# EAGLE design tlcbuffer (EAGLE 5.11)
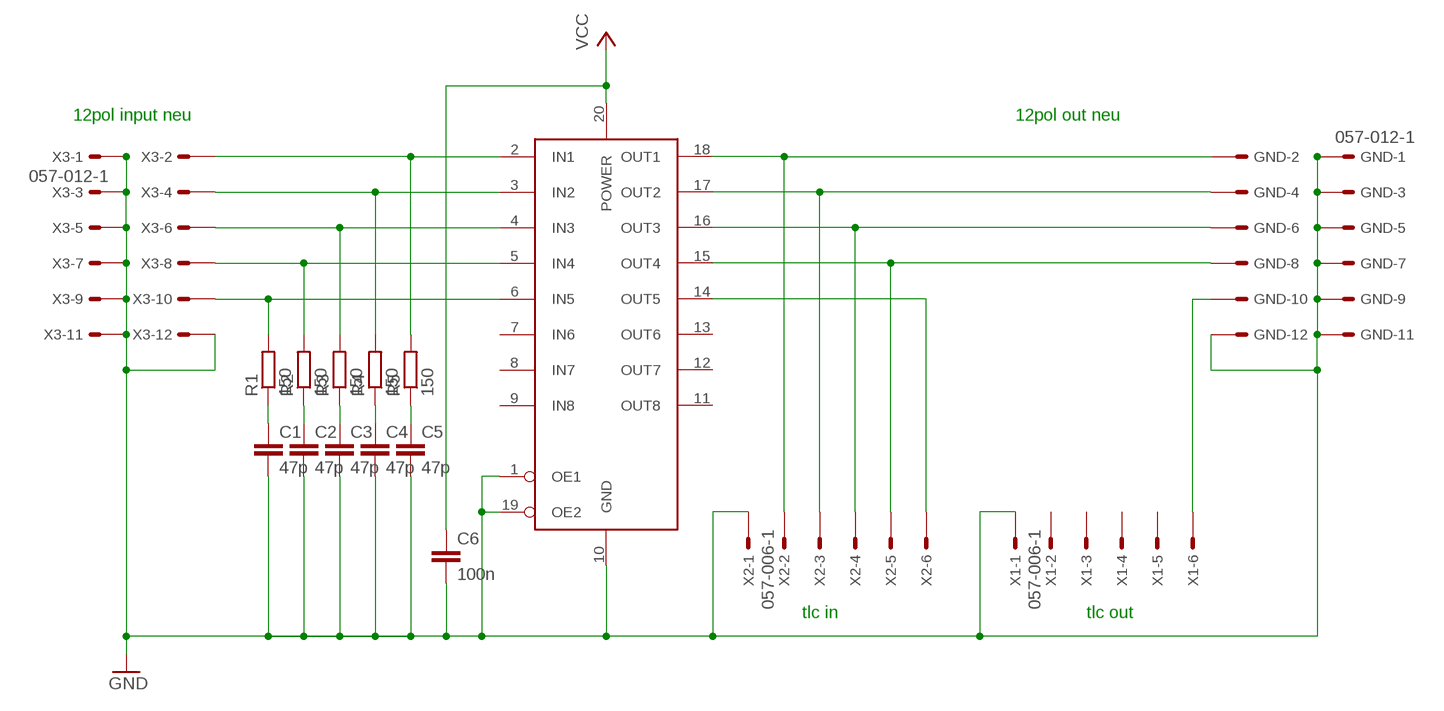
[diagram p0: schematic, sheet 1]

## Parts
C1  47p  C-EU025-025X050  [C025-025X050]
C2  47p  C-EU025-025X050  [C025-025X050]
C3  47p  C-EU025-025X050  [C025-025X050]
C4  47p  C-EU025-025X050  [C025-025X050]
C5  47p  C-EU025-025X050  [C025-025X050]
C6  100n  C-EU025-025X050  [C025-025X050]
GND  057-012-1  [057-014-1]
R1  150  R-EU_0207/10  [0207/10]
R2  150  R-EU_0207/10  [0207/10]
R3  150  R-EU_0207/10  [0207/10]
R4  150  R-EU_0207/10  [0207/10]
R5  150  R-EU_0207/10  [0207/10]
U$1  74541  [DIL20]
X1  057-006-1  [057-006-1]
X2  057-006-1  [057-006-1]
X3  057-012-1  [057-014-1]

## Nets
GND: C1.2 C2.2 C3.2 C4.2 C5.2 C6.2 GND.1 GND.3 GND.5 GND.7 GND.9 GND.11 GND.12 U$1.1(OE1) U$1.10(GND) U$1.19(OE2) X1.1 X2.1 X3.1 X3.3 X3.5 X3.7 X3.9 X3.11 X3.12
N$2: R1.2 U$1.6(IN5) X3.10
N$3: R2.2 U$1.5(IN4) X3.8
N$4: R3.2 U$1.4(IN3) X3.6
N$5: R4.2 U$1.3(IN2) X3.4
N$6: R5.2 U$1.2(IN1) X3.2
N$7: C1.1 R1.1
N$8: C2.1 R2.1
N$9: C3.1 R3.1
N$10: C4.1 R4.1
N$11: C5.1 R5.1
N$12: GND.2 U$1.18(OUT1) X2.2
N$13: GND.4 U$1.17(OUT2) X2.3
N$14: GND.6 U$1.16(OUT3) X2.4
N$15: GND.8 U$1.15(OUT4) X2.5
N$16: U$1.14(OUT5) X2.6
N$17: GND.10 X1.6
POWER: C6.1 U$1.20(POWER) ; supply symbol labelled VCC
Unconnected: U$1.7(IN6) U$1.8(IN7) U$1.9(IN8) U$1.11(OUT8) U$1.12(OUT7) U$1.13(OUT6) X1.2 X1.3 X1.4 X1.5

## Notes on the sheet
- 12pol input neu | 12pol out neu
- tlc in | tlc out

## Library data of the parts
C1-C6 = resistor:C-EU: CAPACITOR, European symbol
GND X3 = pinleisten:057-012-: CONNECTOR 10-pin series 057 contact pc board low profile headers
R1-R5 = rcl:R-EU_: RESISTOR, European symbol
U$1 = 74xx:74*541
X1 X2 = con-panduit:057-006-: CONNECTOR 6-pin series 057 contact pc board low profile headers

## Board
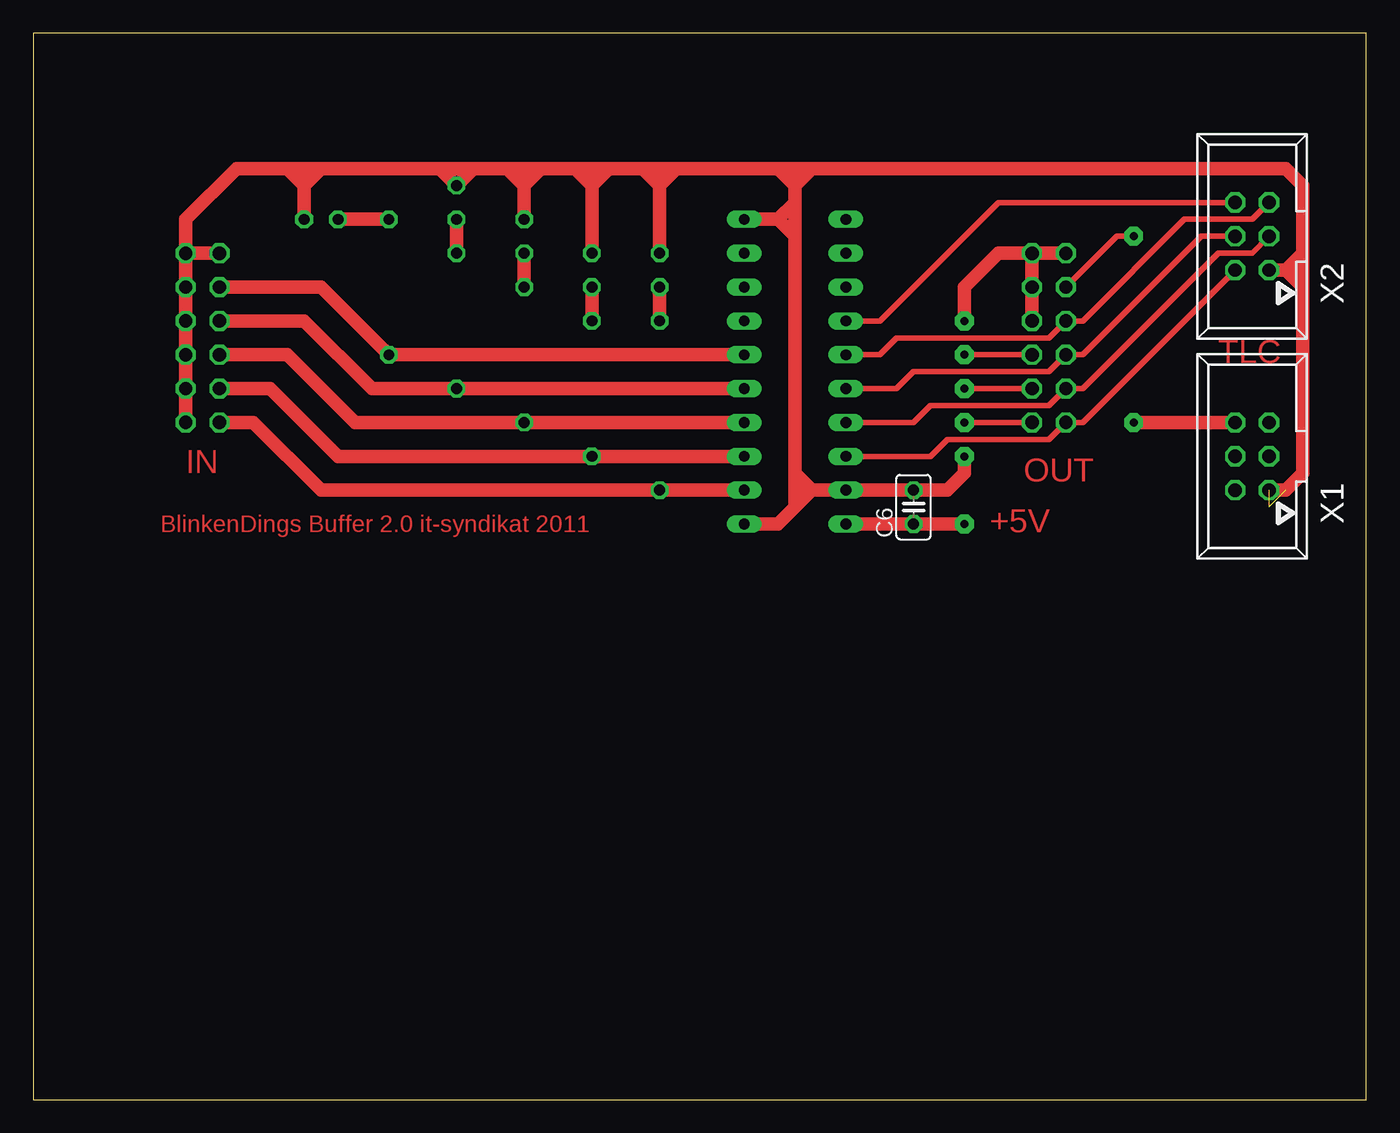
[diagram p1: board, top side]
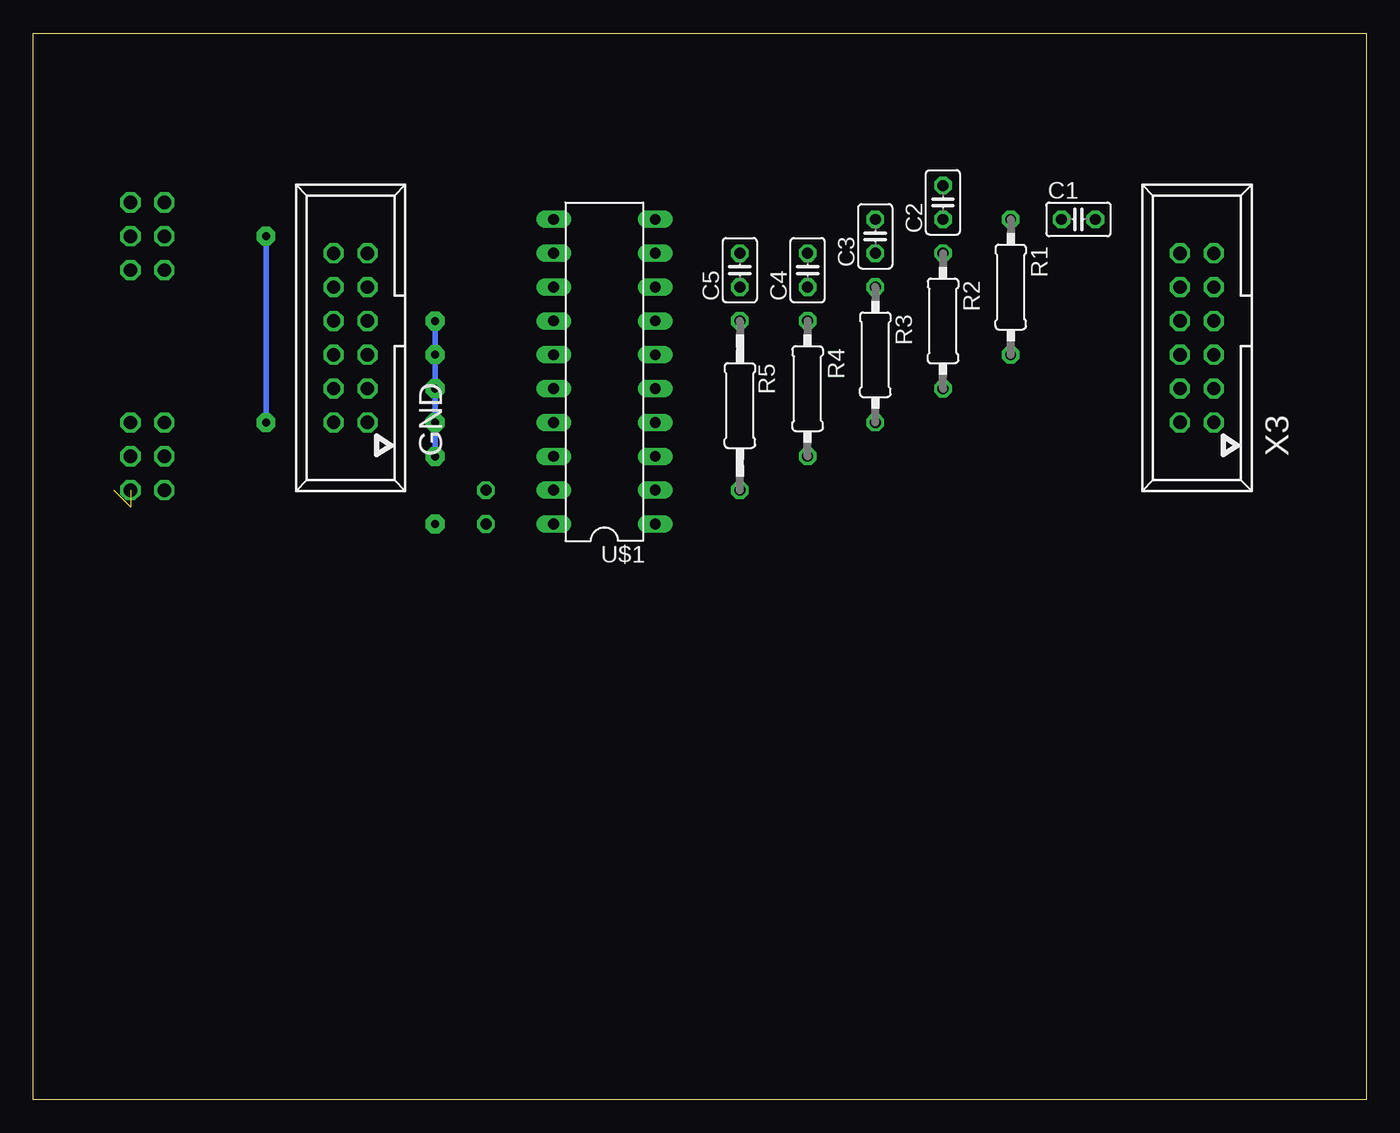
[diagram p2: board, bottom side, seen from below]

Size 100 x 80 mm. Coordinates in mm from the lower left corner, seen from the top.
Outline: 0,0 100,0 100,80 0,80 0,0
Copper layers (1*16): Top 0.035mm / dielectric 1.5mm / Bottom 0.035mm
Design rules "default": minimum track width 10mil, minimum drill 24mil, track to track 8mil, track to pad 8mil, pad to pad 8mil, via to via 8mil, smd to smd 8mil, copper to edge 40mil, drill to drill 8mil, minimum pad ring 10mil, minimum via ring 8mil, stop-mask expansion 4mil, vias tented up to drill 0mil, thermal gap 10mil

### Footprints (pad centres in the part's own frame; a part is rotated, then mirrored left to right if it is on the bottom)
C025-025X050 = drill 0.813 octagon: 1 -1.27,0; 2 1.27,0
057-014-1 = drill 1 octagon: 1 -7.62,-1.27; 2 -7.62,1.27; 3 -5.08,-1.27; 4 -5.08,1.27; 5 -2.54,-1.27; 6 -2.54,1.27; 7 0,-1.27; 8 0,1.27; 9 2.54,-1.27; 10 2.54,1.27; 11 5.08,-1.27; 12 5.08,1.27
0207/10 = drill 0.813 octagon: 1 -5.08,0; 2 5.08,0
0207/12 = drill 0.813 octagon: 1 -6.35,0; 2 6.35,0
DIL20 = drill 0.813 long: 1 -11.43,-3.81; 2 -8.89,-3.81; 3 -6.35,-3.81; 4 -3.81,-3.81; 5 -1.27,-3.81; 6 1.27,-3.81; 7 3.81,-3.81; 8 6.35,-3.81; 9 8.89,-3.81; 10 11.43,-3.81; 11 11.43,3.81; 12 8.89,3.81; 13 6.35,3.81; 14 3.81,3.81; 15 1.27,3.81; 16 -1.27,3.81; 17 -3.81,3.81; 18 -6.35,3.81; 19 -8.89,3.81; 20 -11.43,3.81
057-006-1 = drill 1 octagon: 1 -2.54,-1.27; 2 -2.54,1.27; 3 0,-1.27; 4 0,1.27; 5 2.54,-1.27; 6 2.54,1.27

### Placement (x,y rotation side)
C1  21.59,66.04 0 bottom
C2  31.75,67.31 90 bottom
C3  36.83,64.77 90 bottom
C4  41.91,62.23 90 bottom
C5  46.99,62.23 90 bottom
C6  66.04,44.45 90 top
GND  76.2,58.42 90 bottom
R1  26.67,60.96 270 bottom
R2  31.75,58.42 270 bottom
R3  36.83,55.88 270 bottom
R4  41.91,53.34 270 bottom
R5  150  [0207/12]  46.99,52.07 270 bottom
U$1  57.15,54.61 90 bottom
X1  91.44,48.26 90 top
X2  91.44,64.77 90 top
X3  12.7,58.42 90 bottom

### Tracks (layer width: path | path; a pad name or v marks a point on that pad's centre or on a via)
GND  (via drill 0.6 pad 1.42)  (2 unrouted)
  Top 0.406: v69.85,55.88 GND.5 | v69.85,53.34 GND.3 | v69.85,50.8 GND.1 | GND.11 GND.9
  Top 1.016: X3.1 X3.3 X3.5 X3.7 X3.9 X3.11 | X3.11 X3.12 | 57.15,45.72 58.42,45.72 | 58.42,45.72 U$1.19 C6.2 68.58,45.72 69.85,46.99 v69.85,48.26 | 57.15,64.77 57.15,46.99 | 57.15,46.99 57.15,45.72 | 57.15,64.77 55.88,66.04 | 55.88,66.04 U$1.10 | GND.11 72.39,63.5 69.85,60.96 v69.85,58.42 | X1.1 93.98,45.72 95.25,46.99 95.25,60.96 | 57.15,45.72 57.15,44.45 | 58.42,45.72 57.15,44.45 | 57.15,46.99 58.42,45.72 | 95.25,63.5 95.25,68.58 93.98,69.85 58.42,69.85 | 95.25,63.5 95.25,62.23 | 95.25,62.23 95.25,60.96 | 55.88,69.85 57.15,69.85 | 57.15,69.85 58.42,69.85 | GND.11 GND.12 | 93.98,62.23 X2.1 | 95.25,62.23 93.98,62.23 | 95.25,63.5 93.98,62.23 | 93.98,62.23 95.25,60.96 | 57.15,67.31 57.15,64.77 | 57.15,68.58 57.15,67.31 | 57.15,69.85 57.15,68.58 | 57.15,67.31 55.88,66.04 | 57.15,68.58 58.42,69.85 | 55.88,69.85 57.15,68.58 | X3.11 11.43,66.04 15.24,69.85 19.05,69.85 | 19.05,69.85 20.32,69.85 | 20.32,69.85 21.59,69.85 | 21.59,69.85 30.48,69.85 | 48.26,69.85 55.88,69.85 | 46.99,69.85 48.26,69.85 | 45.72,69.85 46.99,69.85 | 43.18,69.85 45.72,69.85 | 41.91,69.85 43.18,69.85 | 40.64,69.85 41.91,69.85 | 38.1,69.85 40.64,69.85 | 36.83,69.85 38.1,69.85 | 35.56,69.85 36.83,69.85 | 33.02,69.85 35.56,69.85 | 20.32,69.85 20.32,68.58 | 20.32,68.58 C1.2 | 30.48,69.85 C2.2 33.02,69.85 | 20.32,68.58 21.59,69.85 | 19.05,69.85 20.32,68.58 | 30.48,69.85 33.02,69.85 | 36.83,68.58 C3.2 | 36.83,69.85 36.83,68.58 | 41.91,68.58 C4.2 | 41.91,69.85 41.91,68.58 | 46.99,68.58 C5.2 | 46.99,69.85 46.99,68.58 | 35.56,69.85 36.83,68.58 | 36.83,68.58 38.1,69.85 | 40.64,69.85 41.91,68.58 | 41.91,68.58 43.18,69.85 | 45.72,69.85 46.99,68.58 | 46.99,68.58 48.26,69.85 | 57.15,44.45 55.88,43.18 U$1.1 | GND.11 GND.9 GND.7
  Bottom 0.406: v69.85,58.42 v69.85,55.88 v69.85,53.34 v69.85,50.8 v69.85,48.26
N$2
  Top 1.016: R1.2 30.48,55.88 | R1.2 U$1.6 | X3.10 21.59,60.96 R1.2
N$3
  Top 1.016: U$1.5 R2.2 25.4,53.34 20.32,58.42 X3.8
N$4
  Top 1.016: U$1.4 R3.2 24.13,50.8 19.05,55.88 X3.6
N$5
  Top 1.016: U$1.3 R4.2 22.86,48.26 17.78,53.34 X3.4
N$6
  Top 1.016: U$1.2 R5.2 21.59,45.72 16.51,50.8 X3.2
N$7
  Top 1.016: C1.1 R1.1
N$8
  Top 1.016: R2.1 C2.1
N$9
  Top 1.016: R3.1 C3.1
N$10
  Top 1.016: R4.1 C4.1
N$11
  Top 1.016: R5.1 C5.1
N$12
  Top 0.406: U$1.18 67.31,48.26 68.58,49.53 76.2,49.53 GND.2 78.74,50.8 X2.2
N$13
  Top 0.406: X2.3 91.44,63.5 88.9,63.5 78.74,53.34 GND.4 76.2,52.07 75.56,52.07 74.93,52.07 67.31,52.07 66.04,50.8 U$1.17
N$14
  Top 0.406: 88.9,64.77 X2.4 87.63,64.77 78.74,55.88 GND.6 76.2,54.61 75.56,54.61 74.93,54.61 66.04,54.61 64.77,53.34 U$1.16
N$15
  Top 0.406: U$1.15 63.5,55.88 64.77,57.15 76.2,57.15 GND.8 78.74,58.42 86.36,66.04 91.44,66.04 X2.5
N$16
  Top 0.406: U$1.14 62.23,58.42 63.5,58.42 72.39,67.31 X2.6
N$17  (via drill 0.6 pad 1.42)
  Top 0.406: 80.01,63.5 GND.10 81.28,64.77 v82.55,64.77
  Top 1.016: v82.55,50.8 X1.6
  Bottom 0.406: v82.55,50.8 v82.55,64.77
POWER  (via drill 0.6 pad 1.42)
  Top 1.016: v69.85,43.18 C6.1 U$1.20

### Text on the board
Top: TLC | IN | OUT | BlinkenDings Buffer 2.0 it-syndikat 2011 | +5V